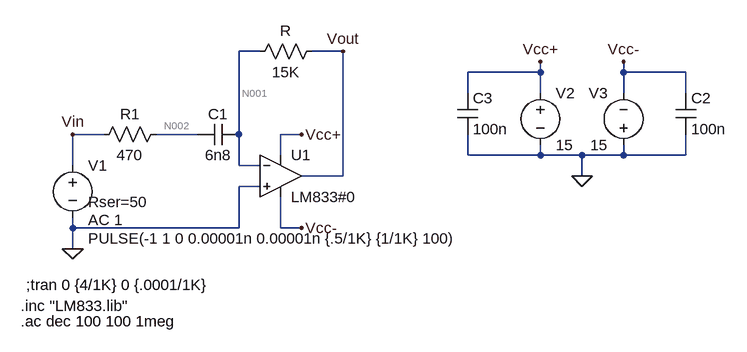
[diagram p0: schematic tp2ej4deriv.asc]
tp2ej4deriv.asc, the LTspice schematic file:
Version 4
SHEET 1 880 680
WIRE -272 -288 -304 -288
WIRE -144 -288 -192 -288
WIRE 160 -256 160 -272
WIRE 160 -256 48 -256
WIRE 288 -256 288 -272
WIRE 384 -256 288 -256
WIRE 48 -224 48 -256
WIRE 160 -224 160 -256
WIRE 288 -224 288 -256
WIRE 384 -224 384 -256
WIRE -512 -160 -560 -160
WIRE -368 -160 -432 -160
WIRE -304 -160 -304 -288
WIRE -208 -160 -240 -160
WIRE -240 -128 -240 -160
WIRE 48 -128 48 -160
WIRE 160 -128 160 -144
WIRE 160 -128 48 -128
WIRE 224 -128 160 -128
WIRE 288 -128 288 -144
WIRE 288 -128 224 -128
WIRE 384 -128 384 -160
WIRE 384 -128 288 -128
WIRE -560 -112 -560 -160
WIRE -304 -112 -304 -160
WIRE -272 -112 -304 -112
WIRE -144 -96 -144 -288
WIRE -144 -96 -208 -96
WIRE 224 -96 224 -128
WIRE -272 -80 -304 -80
WIRE -560 -16 -560 -32
WIRE -304 -16 -304 -80
WIRE -304 -16 -560 -16
WIRE -240 -16 -240 -64
WIRE -208 -16 -240 -16
WIRE -560 16 -560 -16
FLAG -560 16 0
FLAG -208 -16 Vcc-
FLAG -208 -160 Vcc+
FLAG 224 -96 0
FLAG 160 -272 Vcc+
FLAG 288 -272 Vcc-
FLAG -144 -288 Vout
FLAG -560 -160 Vin
SYMBOL voltage -560 -128 R0
WINDOW 123 24 100 Left 2
WINDOW 39 24 72 Left 2
WINDOW 3 24 128 Left 2
SYMATTR Value2 AC 1
SYMATTR SpiceLine Rser=50
SYMATTR Value PULSE(-1 1 0 0.00001n 0.00001n {.5/1K} {1/1K} 100)
SYMATTR InstName V1
SYMBOL cap -304 -176 R90
WINDOW 0 0 32 VBottom 2
WINDOW 3 32 32 VTop 2
SYMATTR InstName C1
SYMATTR Value 6n8
SYMBOL res -176 -304 R90
WINDOW 0 0 56 VBottom 2
WINDOW 3 32 56 VTop 2
SYMATTR InstName R
SYMATTR Value 15K
SYMBOL voltage 160 -240 R0
WINDOW 123 0 0 Left 2
WINDOW 39 0 0 Left 2
SYMATTR InstName V2
SYMATTR Value 15
SYMBOL voltage 288 -128 R180
WINDOW 0 24 96 Left 2
WINDOW 3 24 16 Left 2
WINDOW 123 0 0 Left 2
WINDOW 39 0 0 Left 2
SYMATTR InstName V3
SYMATTR Value 15
SYMBOL Opamps\\opamp2 -240 -160 R0
SYMATTR InstName U1
SYMATTR Value LM833#0
SYMBOL cap 368 -224 R0
SYMATTR InstName C2
SYMATTR Value 100n
SYMBOL cap 32 -224 R0
SYMATTR InstName C3
SYMATTR Value 100n
SYMBOL res -416 -176 R90
WINDOW 0 0 56 VBottom 2
WINDOW 3 32 56 VTop 2
SYMATTR InstName R1
SYMATTR Value 470
TEXT -640 128 Left 2 !.ac dec 100 100 1meg
TEXT -640 104 Left 2 !.inc "LM833.lib"
TEXT -632 72 Left 2 !;tran 0 {4/1K} 0 {.0001/1K}

The netlist it stands for:
* tp2ej4deriv.asc
V1 Vin 0 PULSE(-1 1 0 0.00001n 0.00001n {.5/1K} {1/1K} 100) AC 1 Rser=50
C1 N001 N002 6n8
R Vout N001 15K
V2 Vcc+ 0 15
V3 0 Vcc- 15
XU1 0 N001 Vcc+ Vcc- Vout LM833#0  ; pins In+ In- V+ V- OUT
C2 Vcc- 0 100n
C3 Vcc+ 0 100n
R1 N002 Vin 470
.ac dec 100 100 1meg
.inc "LM833.lib"
;tran 0 {4/1K} 0 {.0001/1K}
.backanno
.end

* Results of the author's LTspice run, read from the files saved beside the schematic
* Operating Point, zero values left out:
*   V(vin) = -1 V
*   V(n001) = -6.413 µV
*   V(n002) = -1 V
*   V(vout) = -4.507 mV
*   V(vcc+) = 15 V
*   V(vcc-) = -15 V
*   I(R) = -300 nA
*   I(V3) = -1.103 mA
*   I(V2) = -1.104 mA
*   Ix(u1:1) = -300 nA
*   Ix(u1:2) = -300 nA
*   Ix(u1:3) = 1.104 mA
*   Ix(u1:4) = -1.103 mA
*   Ix(u1:5) = 300 nA
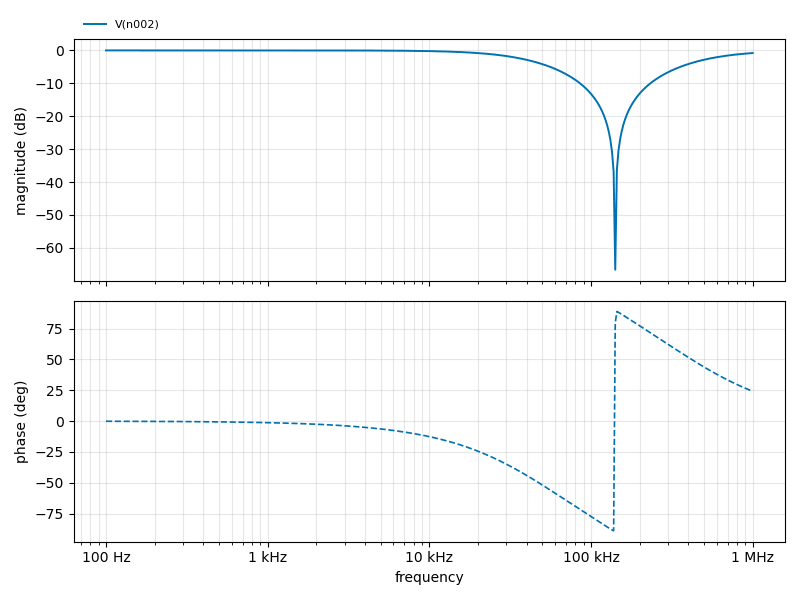
[diagram p1: AC Analysis of tp2ej4deriv.asc, plotted from the saved traces]
* AC Analysis, 1 run:
*   V(n002): -0.00 dB at 100 Hz, -0.80 dB at 1 MHz, peak -0.00 dB at 100 Hz, 3 dB below the peak at 41.17 kHz